# EAGLE schematic InteractionBoard_HallEffect (EAGLE 9.7.0)
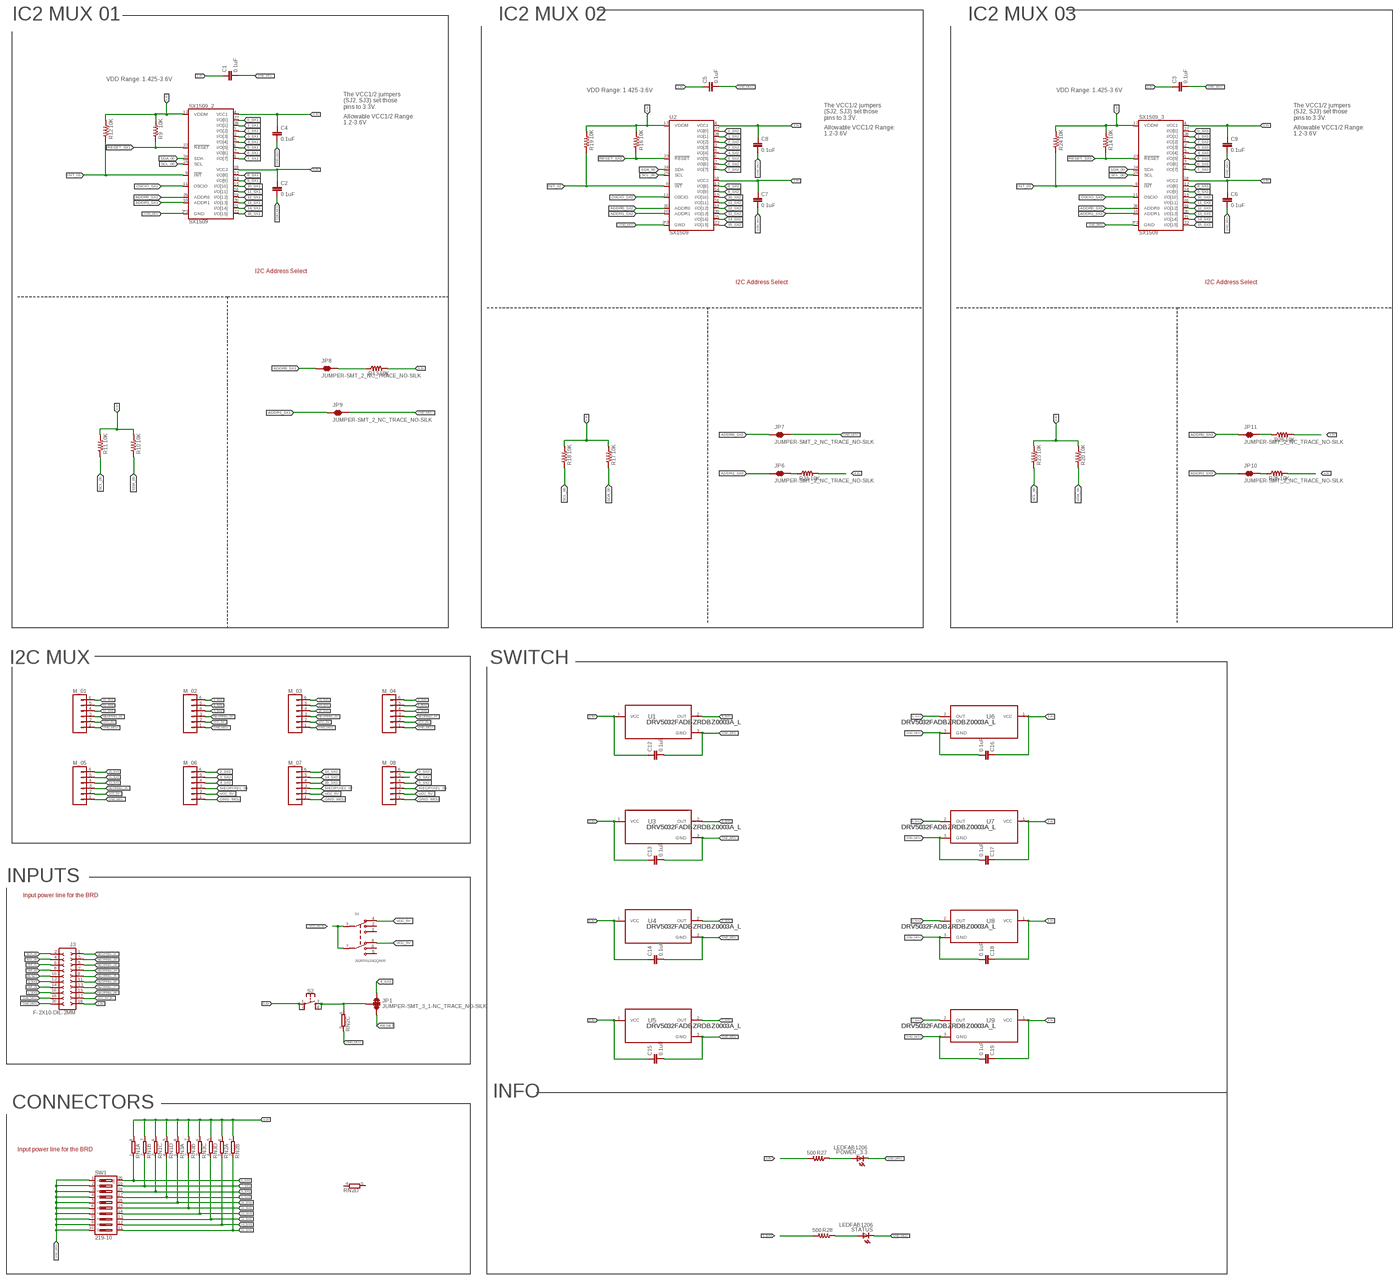
[diagram p0: schematic, sheet 1, overview]
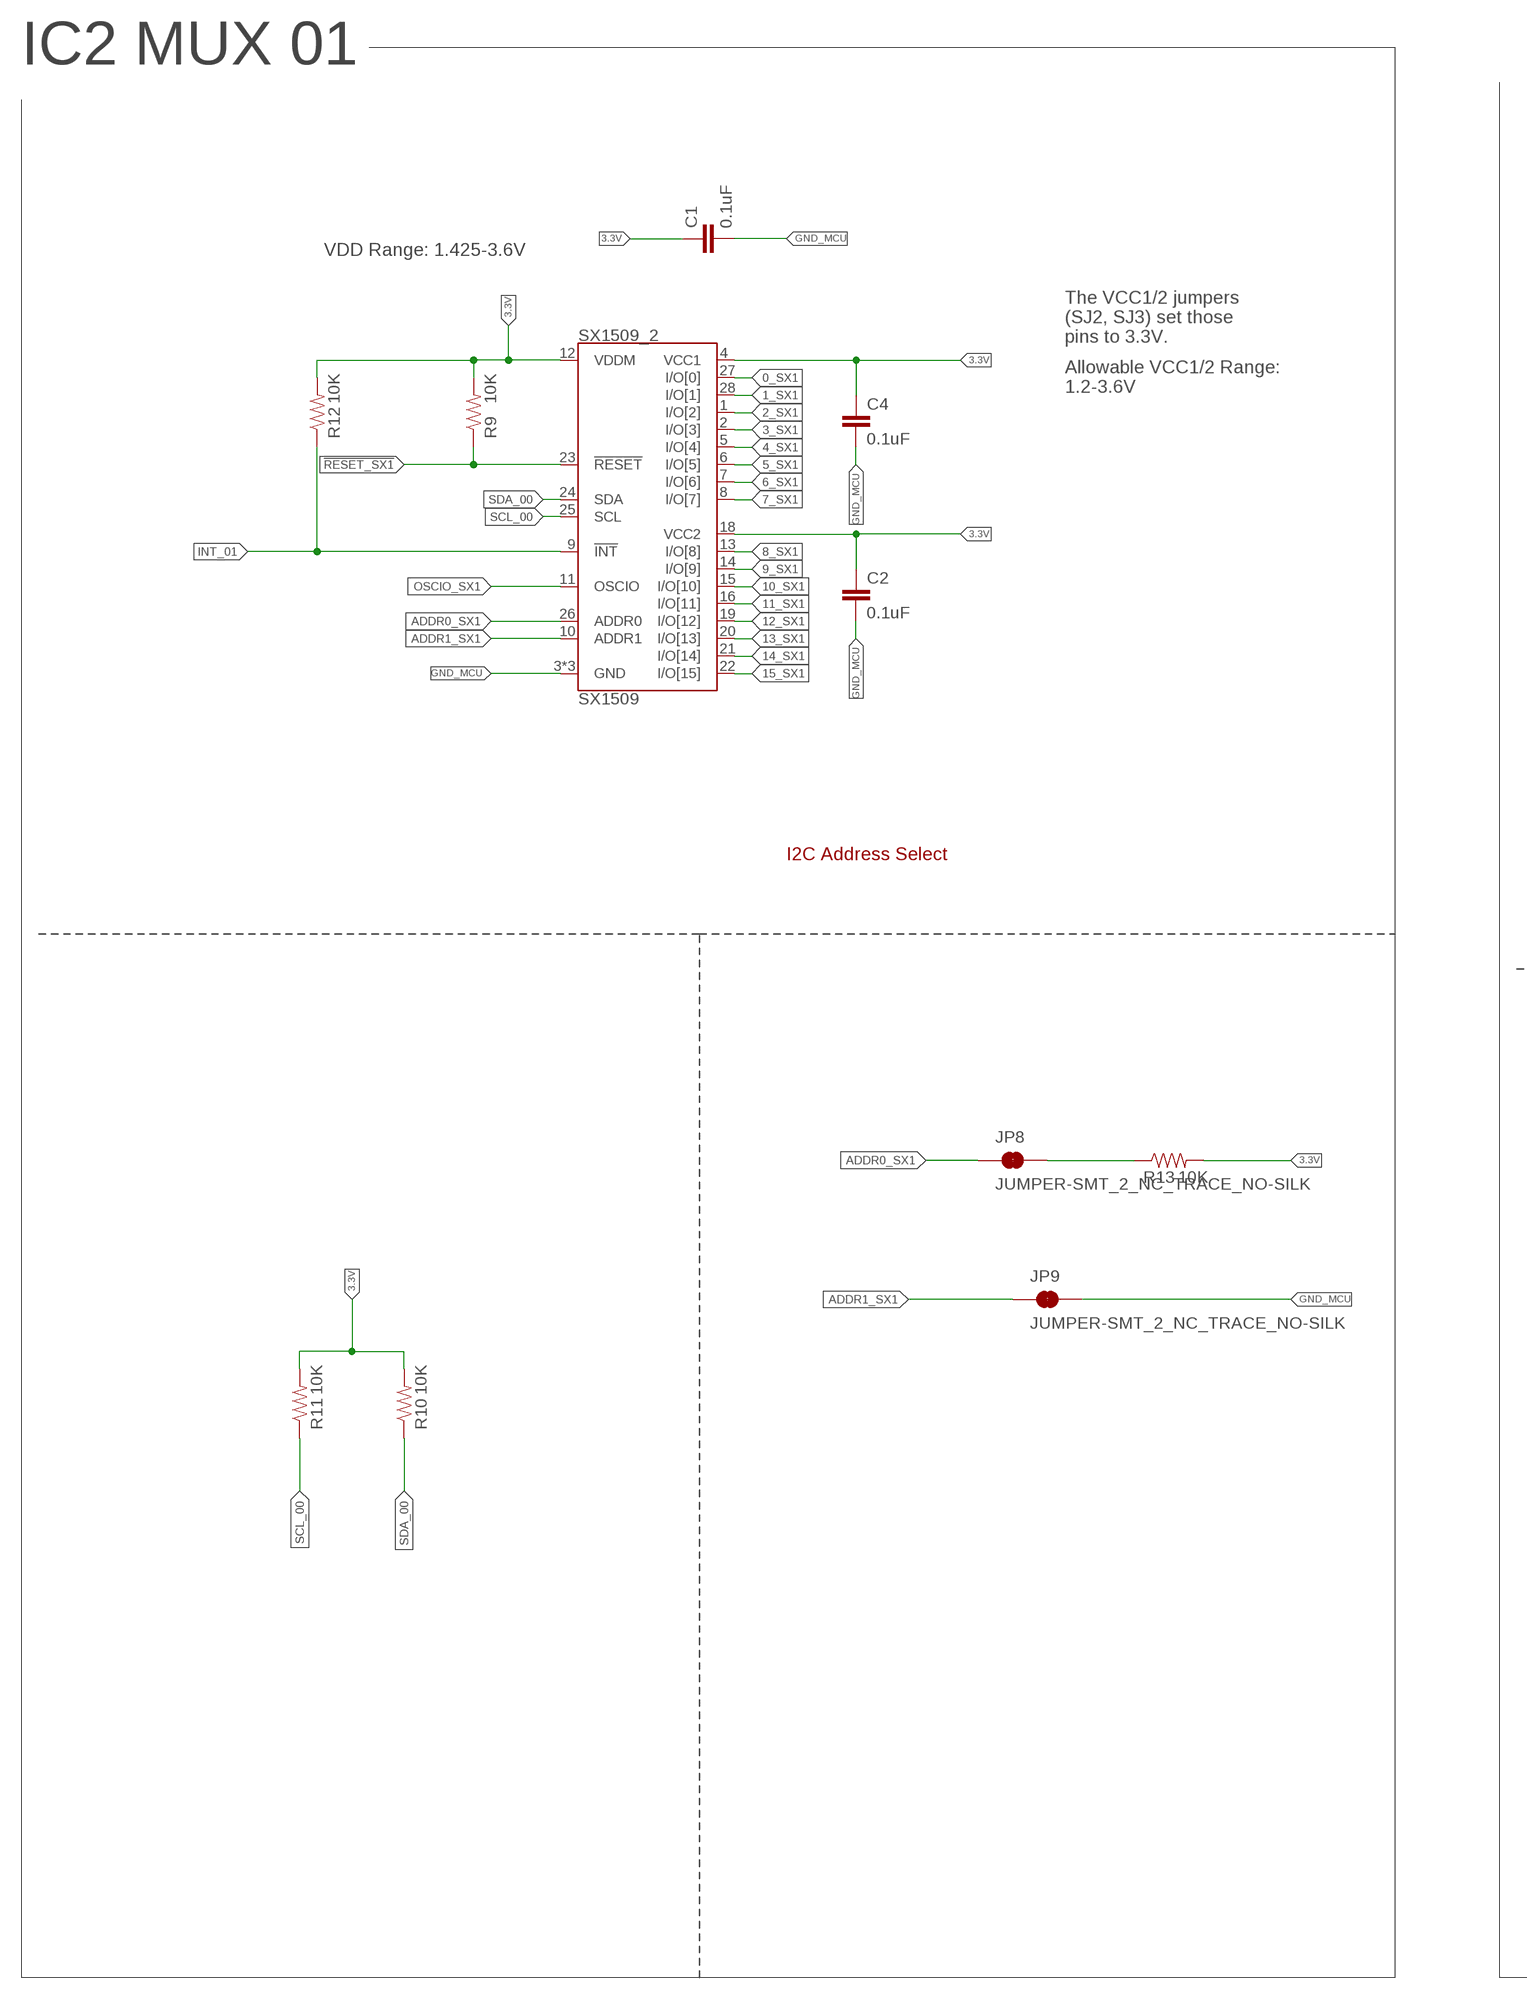
[diagram p1: schematic, sheet 1, part 1 of 4]
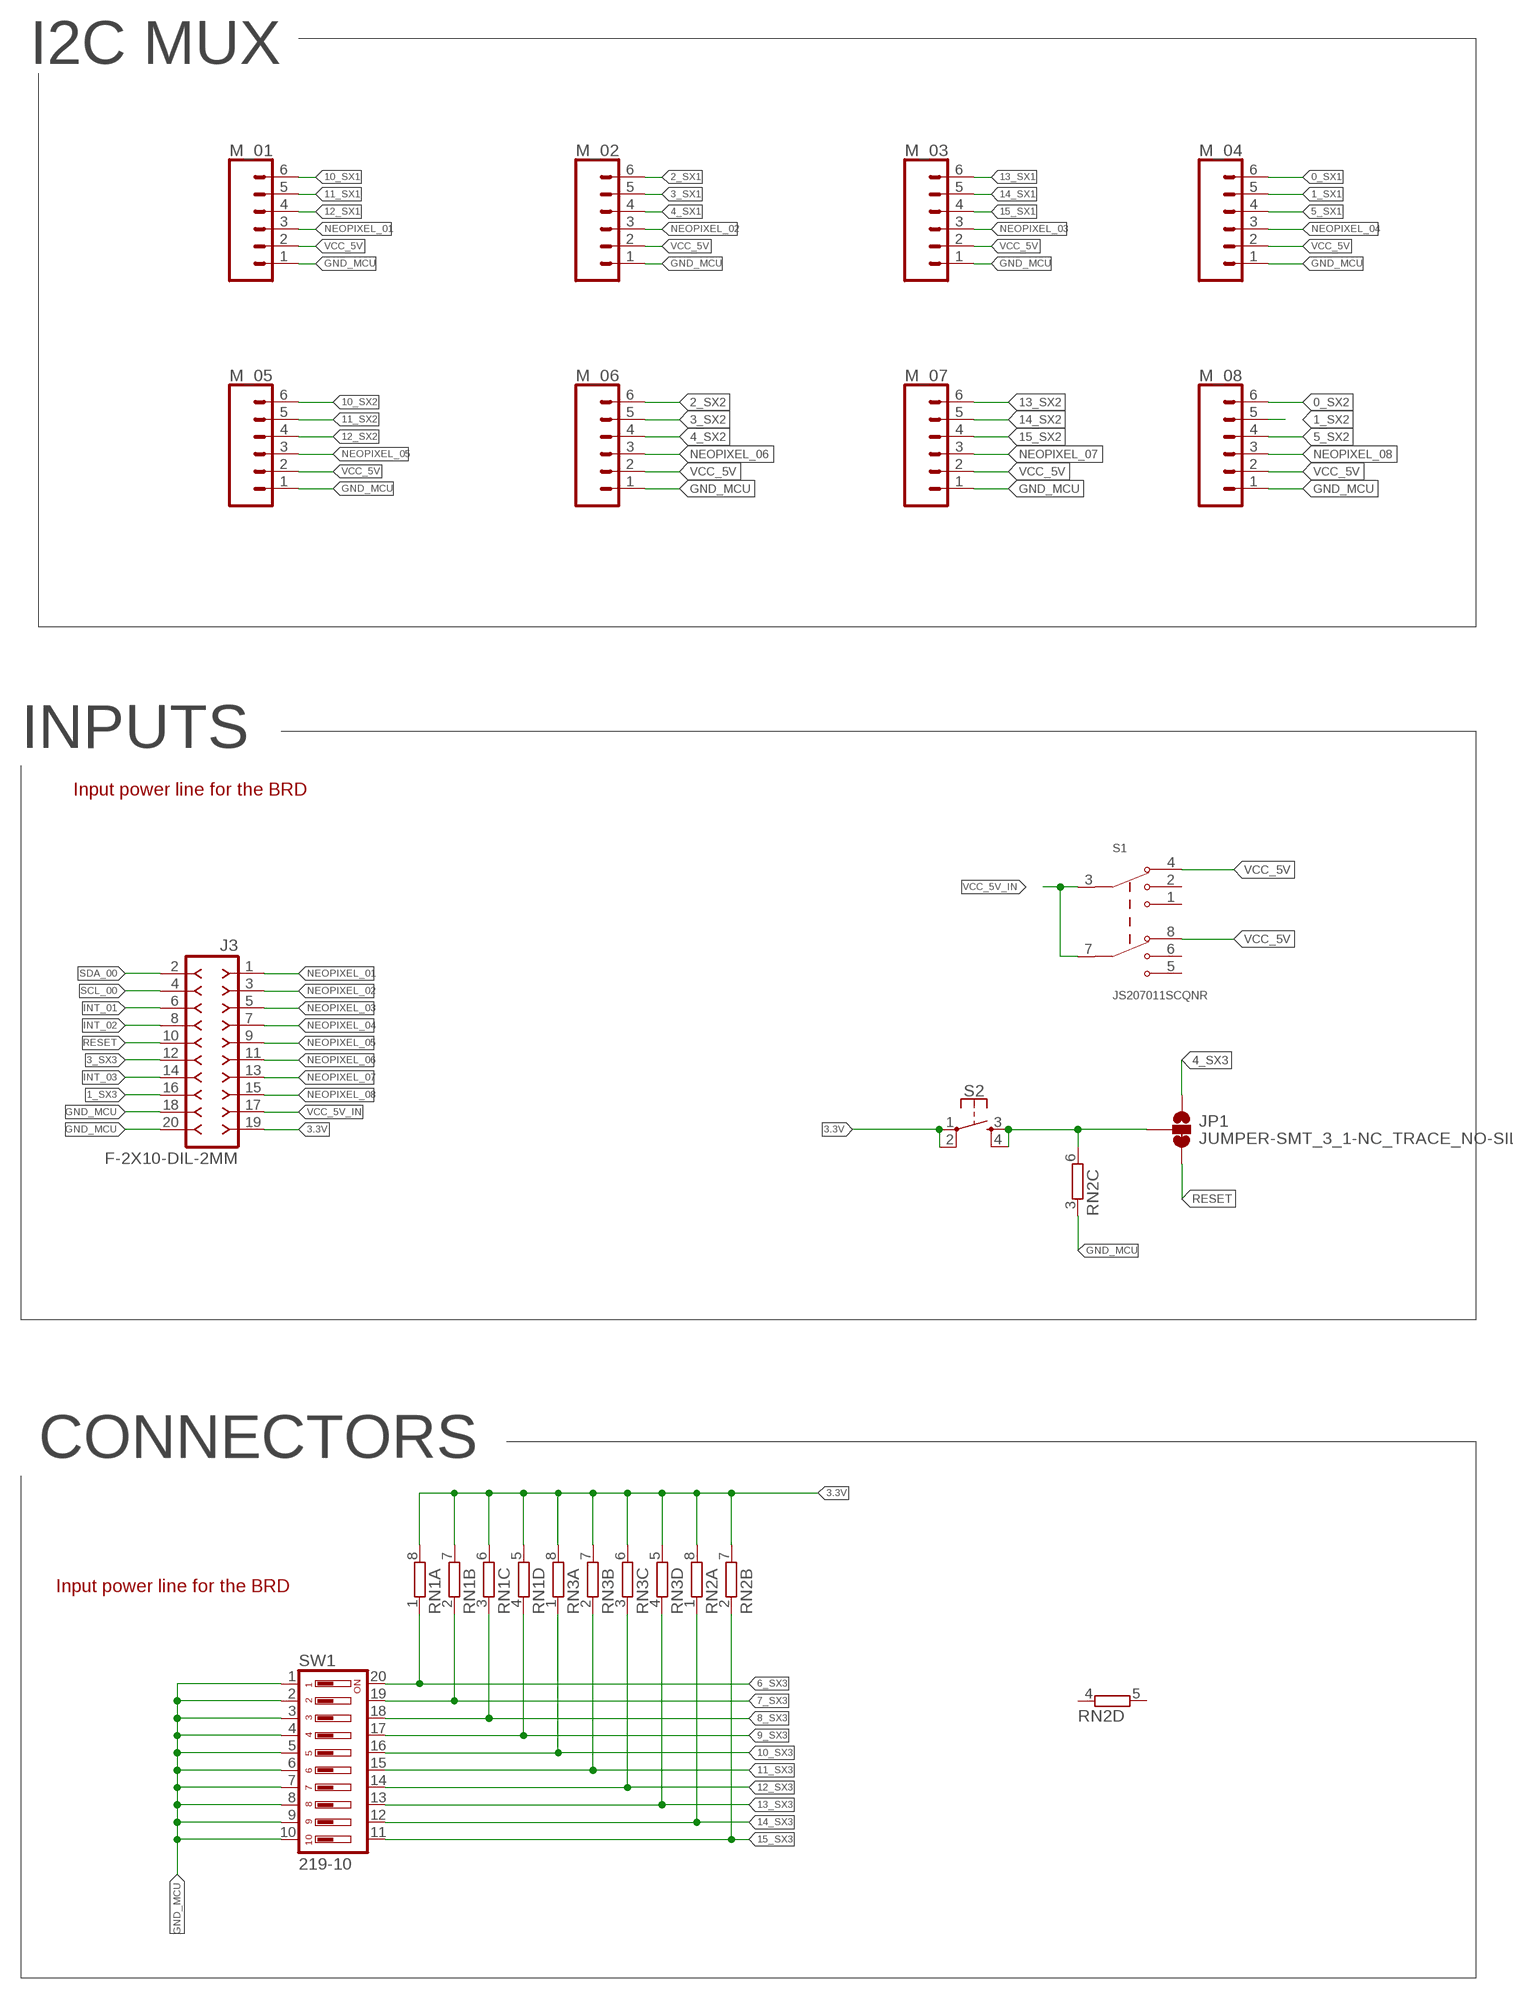
[diagram p2: schematic, sheet 1, part 2 of 4]
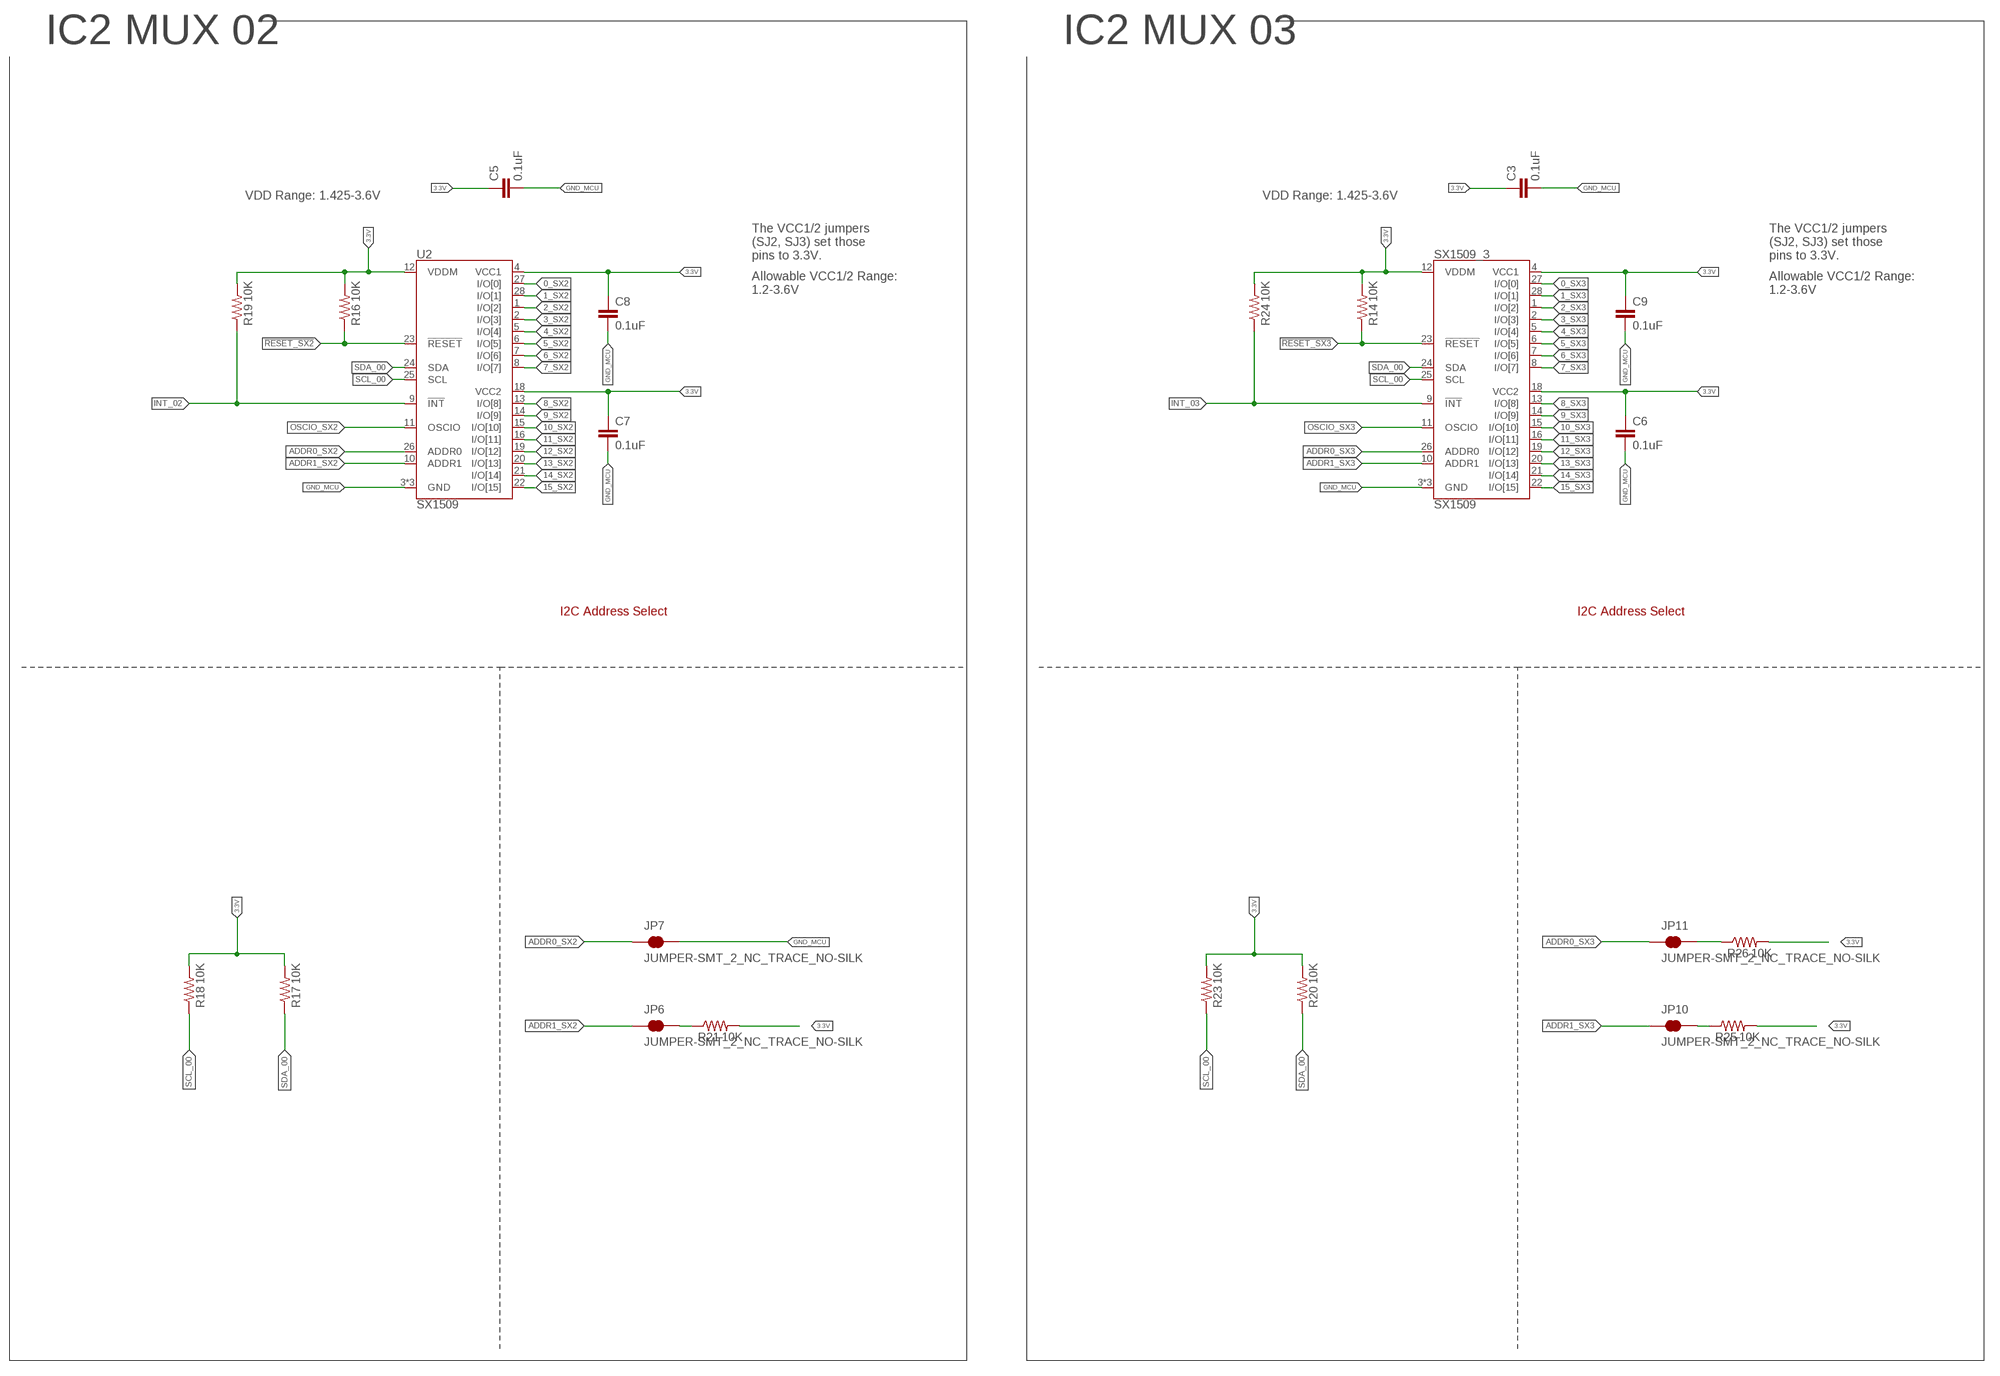
[diagram p3: schematic, sheet 1, part 3 of 4]
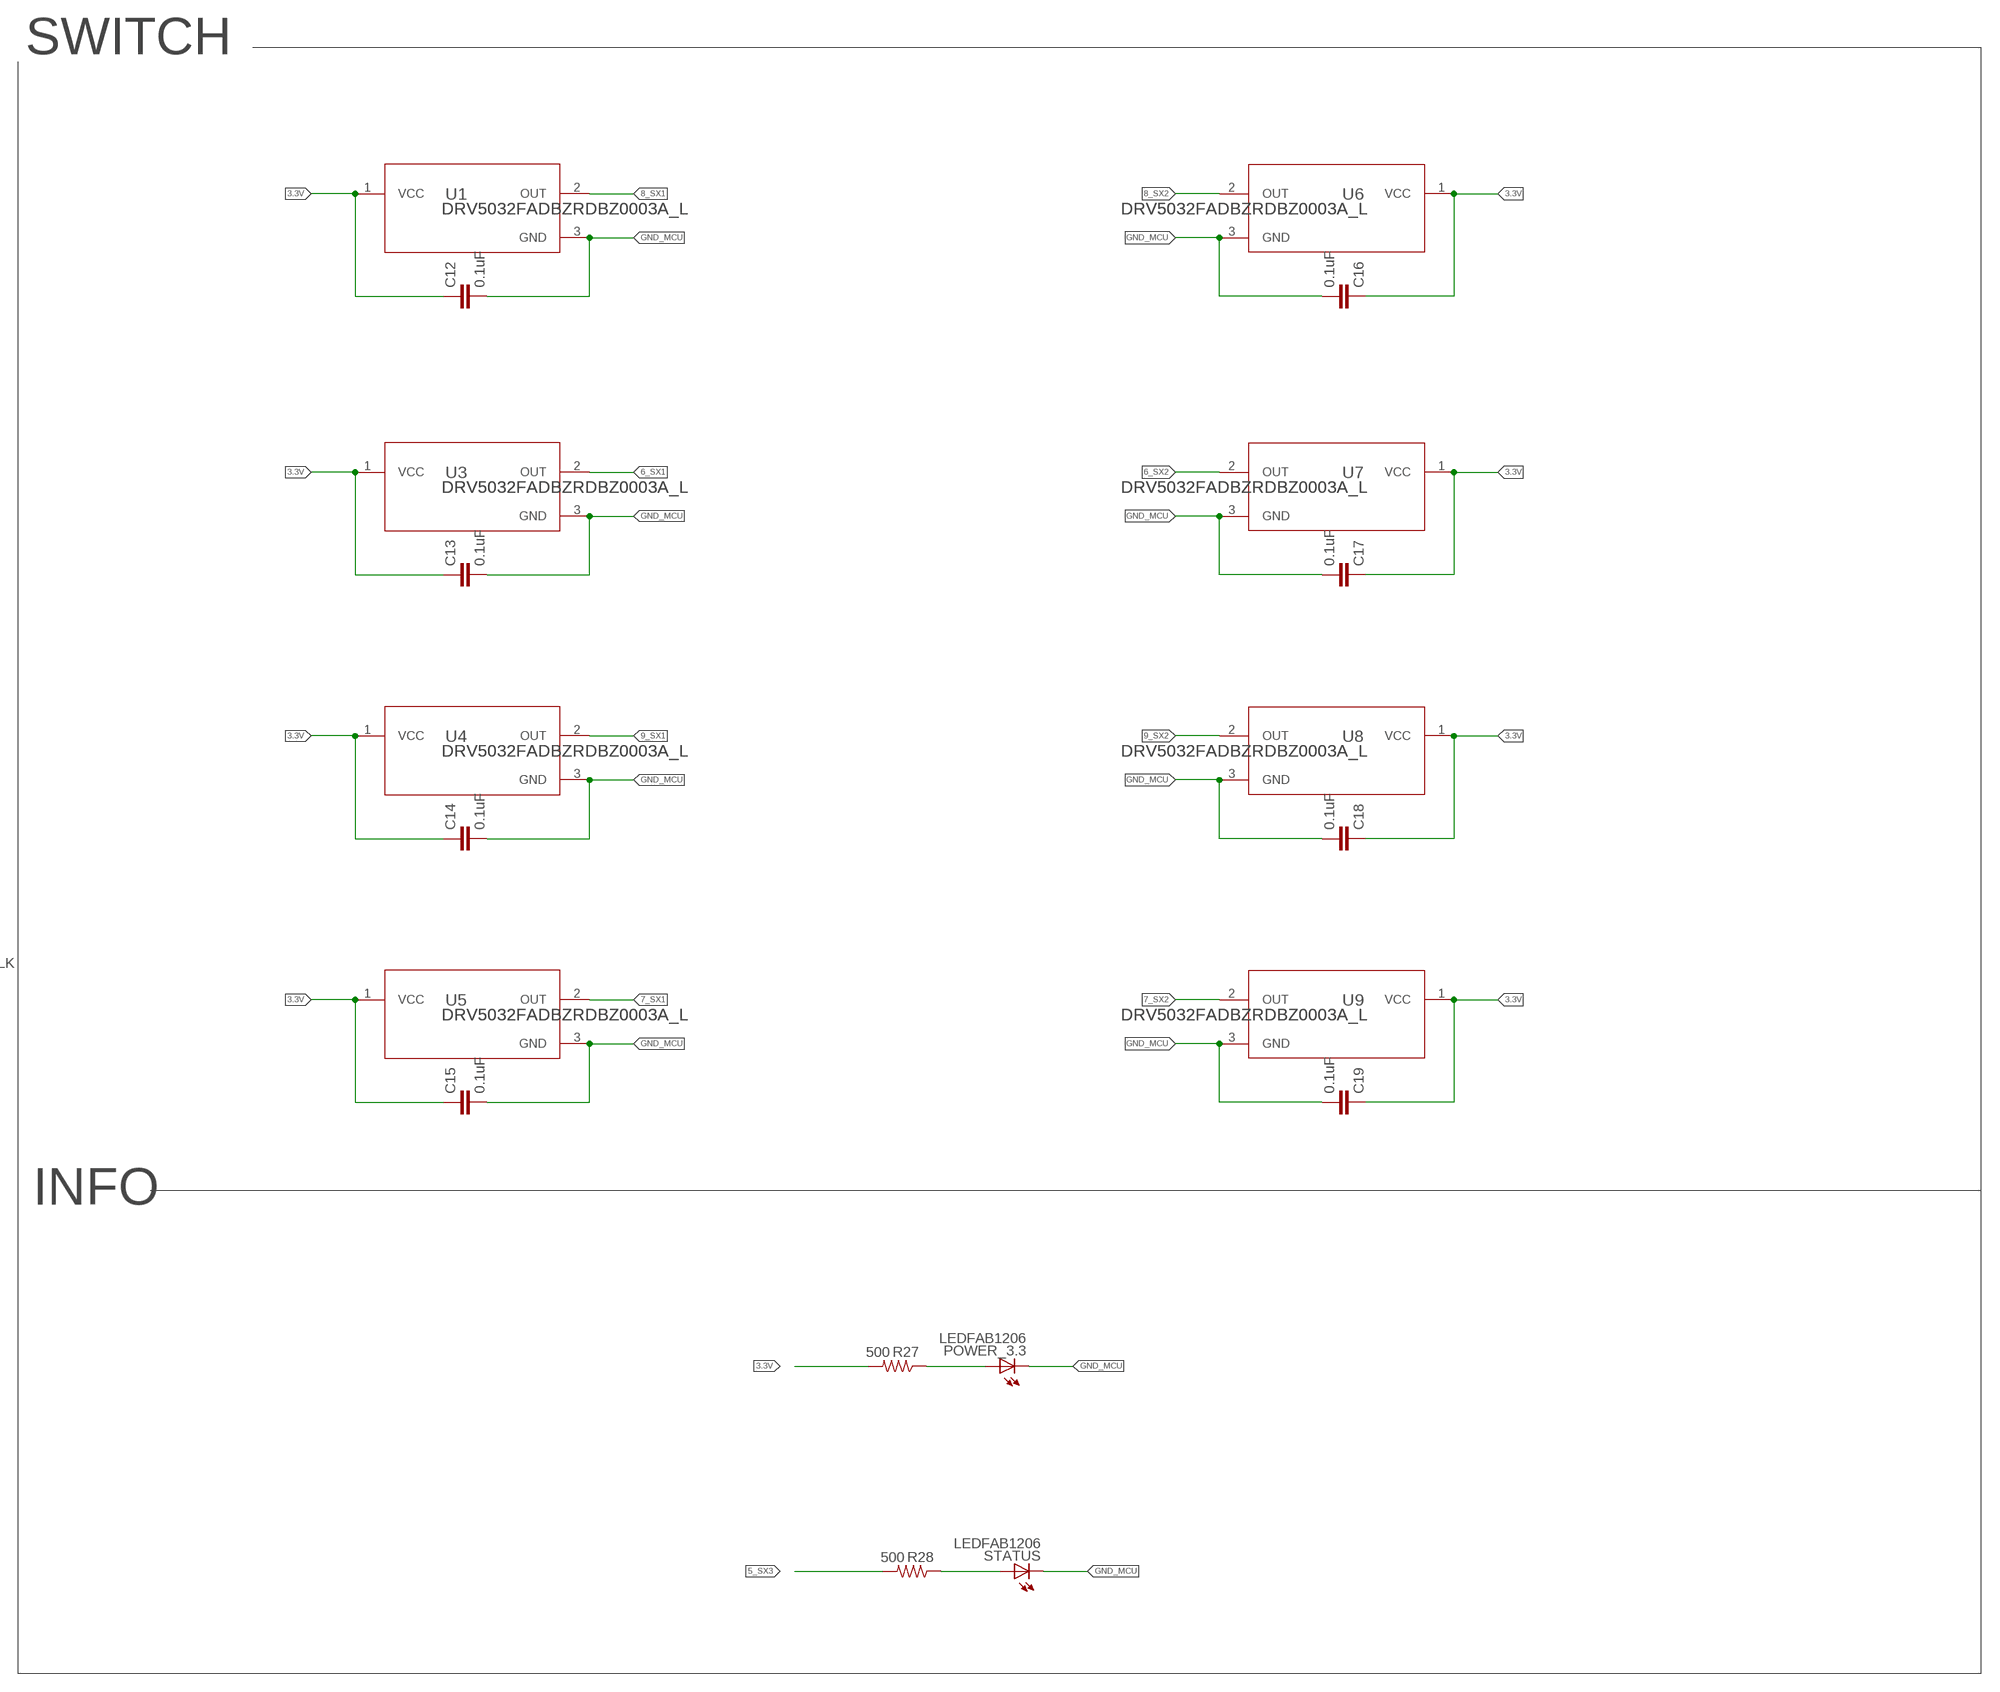
[diagram p4: schematic, sheet 1, part 4 of 4]

## Parts
C1  0.1uF  0.1UF-25V(+80/-20%)(0603)  [0603-CAP]
C2  0.1uF  0.1UF-25V(+80/-20%)(0603)  [0603-CAP]
C3  0.1uF  0.1UF-25V(+80/-20%)(0603)  [0603-CAP]
C4  0.1uF  0.1UF-25V(+80/-20%)(0603)  [0603-CAP]
C5  0.1uF  0.1UF-25V(+80/-20%)(0603)  [0603-CAP]
C6  0.1uF  0.1UF-25V(+80/-20%)(0603)  [0603-CAP]
C7  0.1uF  0.1UF-25V(+80/-20%)(0603)  [0603-CAP]
C8  0.1uF  0.1UF-25V(+80/-20%)(0603)  [0603-CAP]
C9  0.1uF  0.1UF-25V(+80/-20%)(0603)  [0603-CAP]
C12  0.1uF  0.1UF-25V(+80/-20%)(0603)  [0603-CAP]
C13  0.1uF  0.1UF-25V(+80/-20%)(0603)  [0603-CAP]
C14  0.1uF  0.1UF-25V(+80/-20%)(0603)  [0603-CAP]
C15  0.1uF  0.1UF-25V(+80/-20%)(0603)  [0603-CAP]
C16  0.1uF  0.1UF-25V(+80/-20%)(0603)  [0603-CAP]
C17  0.1uF  0.1UF-25V(+80/-20%)(0603)  [0603-CAP]
C18  0.1uF  0.1UF-25V(+80/-20%)(0603)  [0603-CAP]
C19  0.1uF  0.1UF-25V(+80/-20%)(0603)  [0603-CAP]
J3  F-2X10-DIL-2MM  [DIL-2MM-2X10]
JP1  JUMPER-SMT_3_1-NC_TRACE_NO-SILK  [SMT-JUMPER_3_1-NC_TRACE_NO-SILK]
JP6  JUMPER-SMT_2_NC_TRACE_NO-SILK  [SMT-JUMPER_2_NC_TRACE_NO-SILK]
JP7  JUMPER-SMT_2_NC_TRACE_NO-SILK  [SMT-JUMPER_2_NC_TRACE_NO-SILK]
JP8  JUMPER-SMT_2_NC_TRACE_NO-SILK  [SMT-JUMPER_2_NC_TRACE_NO-SILK]
JP9  JUMPER-SMT_2_NC_TRACE_NO-SILK  [SMT-JUMPER_2_NC_TRACE_NO-SILK]
JP10  JUMPER-SMT_2_NC_TRACE_NO-SILK  [SMT-JUMPER_2_NC_TRACE_NO-SILK]
JP11  JUMPER-SMT_2_NC_TRACE_NO-SILK  [SMT-JUMPER_2_NC_TRACE_NO-SILK]
M_01  CONN_06SMD-1MM  [1X06-1MM]
M_02  CONN_06SMD-1MM  [1X06-1MM]
M_03  CONN_06SMD-1MM  [1X06-1MM]
M_04  CONN_06SMD-1MM  [1X06-1MM]
M_05  CONN_06SMD-1MM  [1X06-1MM]
M_06  CONN_06SMD-1MM  [1X06-1MM]
M_07  CONN_06SMD-1MM  [1X06-1MM]
M_08  CONN_06SMD-1MM  [1X06-1MM]
POWER_3.3  LEDFAB1206  [LED1206FAB]
R9  10K  10KOHM-1/10W-1%(0603)0603  [0603-RES]
R10  10K  10KOHM-1/10W-1%(0603)0603  [0603-RES]
R11  10K  10KOHM-1/10W-1%(0603)0603  [0603-RES]
R12  10K  10KOHM-1/10W-1%(0603)0603  [0603-RES]
R13  10K  10KOHM-1/10W-1%(0603)0603  [0603-RES]
R14  10K  10KOHM-1/10W-1%(0603)0603  [0603-RES]
R16  10K  10KOHM-1/10W-1%(0603)0603  [0603-RES]
R17  10K  10KOHM-1/10W-1%(0603)0603  [0603-RES]
R18  10K  10KOHM-1/10W-1%(0603)0603  [0603-RES]
R19  10K  10KOHM-1/10W-1%(0603)0603  [0603-RES]
R20  10K  10KOHM-1/10W-1%(0603)0603  [0603-RES]
R21  10K  10KOHM-1/10W-1%(0603)0603  [0603-RES]
R23  10K  10KOHM-1/10W-1%(0603)0603  [0603-RES]
R24  10K  10KOHM-1/10W-1%(0603)0603  [0603-RES]
R25  10K  10KOHM-1/10W-1%(0603)0603  [0603-RES]
R26  10K  10KOHM-1/10W-1%(0603)0603  [0603-RES]
R27  500  10KOHM-1/10W-1%(0603)0603  [0603-RES]
R28  500  10KOHM-1/10W-1%(0603)0603  [0603-RES]
RN1  4R-NEXB38V  [EXB38V]
RN2  4R-NEXB38V  [EXB38V]
RN3  4R-NEXB38V  [EXB38V]
S1  JS207011SCQNR  [SW_JS207011SCQNR]
S2  MOMENTARY-SWITCH-SPST-2-SMD-5.2MM  [TACTILE_SWITCH_SMD_5.2MM]
STATUS  LEDFAB1206  [LED1206FAB]
SW1  219-10  [CTS-219-10]
SX1509_2  SX1509  [QFN-28]
SX1509_3  SX1509  [QFN-28]
U1  DRV5032FADBZRDBZ0003A_L  [DBZ0003A_L]
U2  SX1509  [QFN-28]
U3  DRV5032FADBZRDBZ0003A_L  [DBZ0003A_L]
U4  DRV5032FADBZRDBZ0003A_L  [DBZ0003A_L]
U5  DRV5032FADBZRDBZ0003A_L  [DBZ0003A_L]
U6  DRV5032FADBZRDBZ0003A_L  [DBZ0003A_L]
U7  DRV5032FADBZRDBZ0003A_L  [DBZ0003A_L]
U8  DRV5032FADBZRDBZ0003A_L  [DBZ0003A_L]
U9  DRV5032FADBZRDBZ0003A_L  [DBZ0003A_L]

## Nets
0_SX1: M_04.6 SX1509_2.27(I/O[0])
0_SX2: M_08.6 U2.27(I/O[0])
0_SX3: SX1509_3.27(I/O[0])
1_SX1: M_04.5 SX1509_2.28(I/O[1])
1_SX2: M_08.5 U2.28(I/O[1])
1_SX3: J3.16 SX1509_3.28(I/O[1])
2_SX1: M_02.6 SX1509_2.1(I/O[2])
2_SX2: M_06.6 U2.1(I/O[2])
2_SX3: SX1509_3.1(I/O[2])
3.3V [3v]: C1.1 C2.1 C3.1 C4.1 C5.1 C6.1 C7.1 C8.1 C9.1 C12.1 C13.1 C14.1 C15.1 C16.1 C17.1 C18.1 C19.1 J3.19 R9.2 R10.2 R11.2 R12.2 R13.2 R14.2 R16.2 R17.2 R18.2 R19.2 R20.2 R21.2 R23.2 R24.2 R25.2 R26.2 R27.2 RN1.5 RN1.6 RN1.7 RN1.8 RN2.7 RN2.8 RN3.5 RN3.6 RN3.7 RN3.8 S2.1 S2.2 SX1509_2.4(VCC1) SX1509_2.12(VDDM) SX1509_2.18(VCC2) SX1509_3.4(VCC1) SX1509_3.12(VDDM) SX1509_3.18(VCC2) U1.1(VCC) U2.4(VCC1) U2.12(VDDM) U2.18(VCC2) U3.1(VCC) U4.1(VCC) U5.1(VCC) U6.1(VCC) U7.1(VCC) U8.1(VCC) U9.1(VCC)
3_SX1: M_02.5 SX1509_2.2(I/O[3])
3_SX2: M_06.5 U2.2(I/O[3])
3_SX3: J3.12 SX1509_3.2(I/O[3])
4_SX1: M_02.4 SX1509_2.5(I/O[4])
4_SX2: M_06.4 U2.5(I/O[4])
4_SX3: JP1.1 SX1509_3.5(I/O[4])
5_SX1: M_04.4 SX1509_2.6(I/O[5])
5_SX2: M_08.4 U2.6(I/O[5])
5_SX3: R28.2 SX1509_3.6(I/O[5])
6_SX1: SX1509_2.7(I/O[6]) U3.2(OUT)
6_SX2: U2.7(I/O[6]) U7.2(OUT)
6_SX3: RN1.1 SW1.20 SX1509_3.7(I/O[6])
7_SX1: SX1509_2.8(I/O[7]) U5.2(OUT)
7_SX2: U2.8(I/O[7]) U9.2(OUT)
7_SX3: RN1.2 SW1.19 SX1509_3.8(I/O[7])
8_SX1: SX1509_2.13(I/O[8]) U1.2(OUT)
8_SX2: U2.13(I/O[8]) U6.2(OUT)
8_SX3: RN1.3 SW1.18 SX1509_3.13(I/O[8])
9_SX1: SX1509_2.14(I/O[9]) U4.2(OUT)
9_SX2: U2.14(I/O[9]) U8.2(OUT)
9_SX3: RN1.4 SW1.17 SX1509_3.14(I/O[9])
10_SX1: M_01.6 SX1509_2.15(I/O[10])
10_SX2: M_05.6 U2.15(I/O[10])
10_SX3: RN3.1 SW1.16 SX1509_3.15(I/O[10])
11_SX1: M_01.5 SX1509_2.16(I/O[11])
11_SX2: M_05.5 U2.16(I/O[11])
11_SX3: RN3.2 SW1.15 SX1509_3.16(I/O[11])
12_SX1: M_01.4 SX1509_2.19(I/O[12])
12_SX2: M_05.4 U2.19(I/O[12])
12_SX3: RN3.3 SW1.14 SX1509_3.19(I/O[12])
13_SX1: M_03.6 SX1509_2.20(I/O[13])
13_SX2: M_07.6 U2.20(I/O[13])
13_SX3: RN3.4 SW1.13 SX1509_3.20(I/O[13])
14_SX1: M_03.5 SX1509_2.21(I/O[14])
14_SX2: M_07.5 U2.21(I/O[14])
14_SX3: RN2.1 SW1.12 SX1509_3.21(I/O[14])
15_SX1: M_03.4 SX1509_2.22(I/O[15])
15_SX2: M_07.4 U2.22(I/O[15])
15_SX3: RN2.2 SW1.11 SX1509_3.22(I/O[15])
!RESET_SX1: R9.1 SX1509_2.23(!RESET)
!RESET_SX2: R16.1 U2.23(!RESET)
!RESET_SX3: R14.1 SX1509_3.23(!RESET)
ADDR0_SX1: JP8.1 SX1509_2.26(ADDR0)
ADDR0_SX2: JP7.1 U2.26(ADDR0)
ADDR0_SX3: JP11.1 SX1509_3.26(ADDR0)
ADDR1_SX1: JP9.1 SX1509_2.10(ADDR1)
ADDR1_SX2: JP6.1 U2.10(ADDR1)
ADDR1_SX3: JP10.1 SX1509_3.10(ADDR1)
GND_MCU: C1.2 C2.2 C3.2 C4.2 C5.2 C6.2 C7.2 C8.2 C9.2 C12.2 C13.2 C14.2 C15.2 C16.2 C17.2 C18.2 C19.2 J3.18 J3.20 JP7.2 JP9.2 M_01.1 M_02.1 M_03.1 M_04.1 M_05.1 M_06.1 M_07.1 M_08.1 POWER_3.3.2(C) RN2.3 STATUS.2(C) SW1.1 SW1.2 SW1.3 SW1.4 SW1.5 SW1.6 SW1.7 SW1.8 SW1.9 SW1.10 SX1509_2.3(GND) SX1509_2.17(GND) SX1509_2.29(GND) SX1509_3.3(GND) SX1509_3.17(GND) SX1509_3.29(GND) U1.3(GND) U2.3(GND) U2.17(GND) U2.29(GND) U3.3(GND) U4.3(GND) U5.3(GND) U6.3(GND) U7.3(GND) U8.3(GND) U9.3(GND)
INT_01: J3.6 R12.1 SX1509_2.9(!INT)
INT_02: J3.8 R19.1 U2.9(!INT)
INT_03: J3.14 R24.1 SX1509_3.9(!INT)
N$5: JP6.2 R21.1
N$8: JP8.2 R13.1
N$13: R28.1 STATUS.1(A)
N$14: JP10.2 R25.1
N$15: JP11.2 R26.1
N$193: POWER_3.3.1(A) R27.1
NEOPIXEL_01: J3.1 M_01.3
NEOPIXEL_02: J3.3 M_02.3
NEOPIXEL_03: J3.5 M_03.3
NEOPIXEL_04: J3.7 M_04.3
NEOPIXEL_05: J3.9 M_05.3
NEOPIXEL_06: J3.11 M_06.3
NEOPIXEL_07: J3.13 M_07.3
NEOPIXEL_08: J3.15 M_08.3
OSCIO_SX1: SX1509_2.11(OSCIO)
OSCIO_SX2: U2.11(OSCIO)
OSCIO_SX3: SX1509_3.11(OSCIO)
RESET: J3.10 JP1.2 JP1.3 RN2.6 S2.3 S2.4
SCL_00: J3.4 R11.1 R18.1 R23.1 SX1509_2.25(SCL) SX1509_3.25(SCL) U2.25(SCL)
SDA_00: J3.2 R10.1 R17.1 R20.1 SX1509_2.24(SDA) SX1509_3.24(SDA) U2.24(SDA)
VCC_5V [5v]: M_01.2 M_02.2 M_03.2 M_04.2 M_05.2 M_06.2 M_07.2 M_08.2 S1.4 S1.8
VCC_5V_IN [5v]: J3.17 S1.3 S1.7
Unconnected: RN2.4 RN2.5 S1.1 S1.2 S1.5 S1.6

## Notes on the sheet
- IC2 MUX 01 | IC2 MUX 02 | IC2 MUX 03
- VDD Range: 1.425-3.6V
- VDD Range: 1.425-3.6V | VDD Range: 1.425-3.6V
- The VCC1/2 jumpers 
  (SJ2, SJ3) set those 
  pins to 3.3V.
- Allowable VCC1/2 Range: 
  1.2-3.6V
- The VCC1/2 jumpers 
  (SJ2, SJ3) set those 
  pins to 3.3V.
- The VCC1/2 jumpers 
  (SJ2, SJ3) set those 
  pins to 3.3V.
- Allowable VCC1/2 Range: 
  1.2-3.6V
- Allowable VCC1/2 Range: 
  1.2-3.6V
- I2C Address Select
- I2C Address Select | I2C Address Select
- I2C MUX | SWITCH
- INPUTS
- Input power line for the BRD
- INFO
- CONNECTORS
- Input power line for the BRD

## Library data of the parts
C1-C9 C12-C19 = SparkFun-Capacitors:0.1UF-25V(+80/-20%)(0603): CAP-00810 Ceramic Standard decoupling cap; PROD_ID: CAP-00810
J3 = con-headers-jp:F-2X10-: FEMALE HEADER
JP1 = SparkFun-Jumpers:JUMPER-SMT_3_1-NC_TRACE: Normally closed trace jumper (1 of 2 connections) This jumper has a trace between two pads so it's normally closed (NC). The other connection is normally open (NO). Use a razor knife to open the connection. For best results follow the IPC guidelines for cutting traces: Cutout at least 0.063 mm (0.005 in). Remove all loose material to clean up the cut area. Seal the cut with an approved epoxy. Reapply solder to reclose the connection, or to close the NO connection.
JP6-JP11 = SparkFun-Jumpers:JUMPER-SMT_2_NC_TRACE: Normally closed trace jumper This jumper has a trace between two pads so it's normally closed (NC). Use a razor knife to open the connection. For best results follow the IPC guidelines for cutting traces: Cutout at least 0.063 mm (0.005 in). Remove all loose material to clean up the cut area. Seal the cut with an approved epoxy. Reapply solder to reclose the connection.
M_01-M_08 = SparkFun-Connectors:CONN_06: Multi connection point. Often used as Generic Header-pin footprint for 0.1 inch spaced/style header connections On any of the 0.1 inch spaced packages, you can populate with these: Break Away Headers - Straight <https://www.sparkfun.com/products/116> (PRT-00116) Break Away Male Headers - Right Angle <https://www.sparkfun.com/products/553> (PRT-00553) Female Headers <https://www.sparkfun.com/products/115> (PRT-00115) Break Away Headers - Machine Pin <https://www.sparkfun.com/products/117> (PRT-00117) Break Away Female Headers - Swiss Machine Pin <https://www.sparkfun.com/products/743> (PRT-00743) Arduino Stackable Header - 6 Pin <https://www.sparkfun.com/products/9280> (PRT-09280) For SCREWTERMINALS and SPRING TERMINALS visit here: Screw Terimnals on SparkFun.com <https://www.sparkfun.com/search/results?term=Screw+Terminals> (5mm/3.5mm/2.54mm spacing) This device is also useful as a general connection point to wire up your design to another part of your project. Our various solder wires solder well into these plated through hole pads. Hook-Up Wire - Assortment (Stranded, 22 AWG) <https://www.sparkfun.com/products/11375> (PRT-11375) Hook-Up Wire - Assortment (Solid Core, 22 AWG) <https://www.sparkfun.com/products/11367> (PRT-11367) View the entire wire category on our website here <https://www.sparkfun.com/categories/141>; PROD_ID: CONN-08249; SF_ID: GPS-00579
POWER_3.3 STATUS = fab:LED: LED
R9-R14 R16-R21 R23-R26 = SparkFun-Resistors:10KOHM-1/10W-1%(0603): RES-00824; PROD_ID: RES-00824
R27 R28 = SparkFun-Resistors:10KOHM-1/10W-1%(0603): RES-00824; PROD_ID: RES-00824; VALUE: 10K
RN1-RN3 = resistor-dil:4R-N: Array Chip Resistor Source: RS Component / Phycomp; OC_FARNELL: unknown; OC_NEWARK: unknown
S1 = JS207011SCQNR:JS207011SCQNR: Js Series Sub-Miniature Slide Switches; AVAILABILITY: Unavailable; DESCRIPTION: Slide Switch DP3T Surface Mount; MF: C&K; MP: JS207011SCQNR; PACKAGE: None; PRICE: None
S2 = SparkFun-Switches:MOMENTARY-SWITCH-SPST-2: Momentary Switch (Pushbutton) - SPST - Two Circuits Normally-open (NO) SPST momentary switches (buttons, pushbuttons). Schematic symbol includes two switch circuits. Variants SMD-4.6MMX2.8MM - 4.60mm x 2.80mm Tactile Momentary Button Switch - Used on SparkFun SAMD21 Mini Breakout <https://www.sparkfun.com/products/13664> SMD-5.2MM - Mini Pushbutton Switch - SMD <https://www.sparkfun.com/products/8720> - Used on Arduino Pro Mini <https://www.sparkfun.com/products/11114>; PROD_ID: SWCH-08247; SF_SKU: COM-08720
SW1 = switch-dil:219-10*: Surface Mount DIP Switch Series 219 SMT CTS Electronic Components Sourc: www.ctscorp.com; MF: SLI (CML/IDI); MPN: 219-10PK; OC_FARNELL: unknown; OC_NEWARK: 19M0224
SX1509_2 SX1509_3 U2 = SparkFun-DigitalIC:SX1509: Semtech SX1509 The SX1509 is a complete ultra low voltage 1.2V to 3.6V General Purpose parallel Input/Output (GPIO) expanders ideal for low power handheld battery powered equipment. This version comes in a 16-channel configuration and allows easy serial expansion of I/O through a standard 400kHz I2C interface. GPIO devices can provide additional control and monitoring when the microcontroller or chipset has insufficient I/O ports, or in systems where serial communication and control from a remote location is advantageous.; PROD_ID: IC-11311
U1 U3-U9 = 2023-08-01_17-56-42_Library:DRV5032FADBZR; COPYRIGHT: Copyright (C) 2023 Ultra Librarian. All rights reserved.; DIGI-KEY_PART_NUMBER_1: 296-47765-1-ND; DIGI-KEY_PART_NUMBER_2: 296-47765-2-ND; DIGI-KEY_PART_NUMBER_3: 296-47765-6-ND; MANUFACTURER_PART_NUMBER: DRV5032FADBZR; MFR_NAME: Texas Instruments; REFDES: RefDes; TYPE: TYPE

## Net classes
0 default: width 0.2 mm, clearance 0.2 mm
1 gnd: width 0.3 mm, clearance 0.2 mm to class 0, clearance 0.2 mm
2 3v: width 0.2 mm, clearance 0.2 mm
4 5v: width 0.4 mm, clearance 0.2 mm to class 0, clearance 0.2 mm